# Altium project Incubator_PCB.PrjPcb
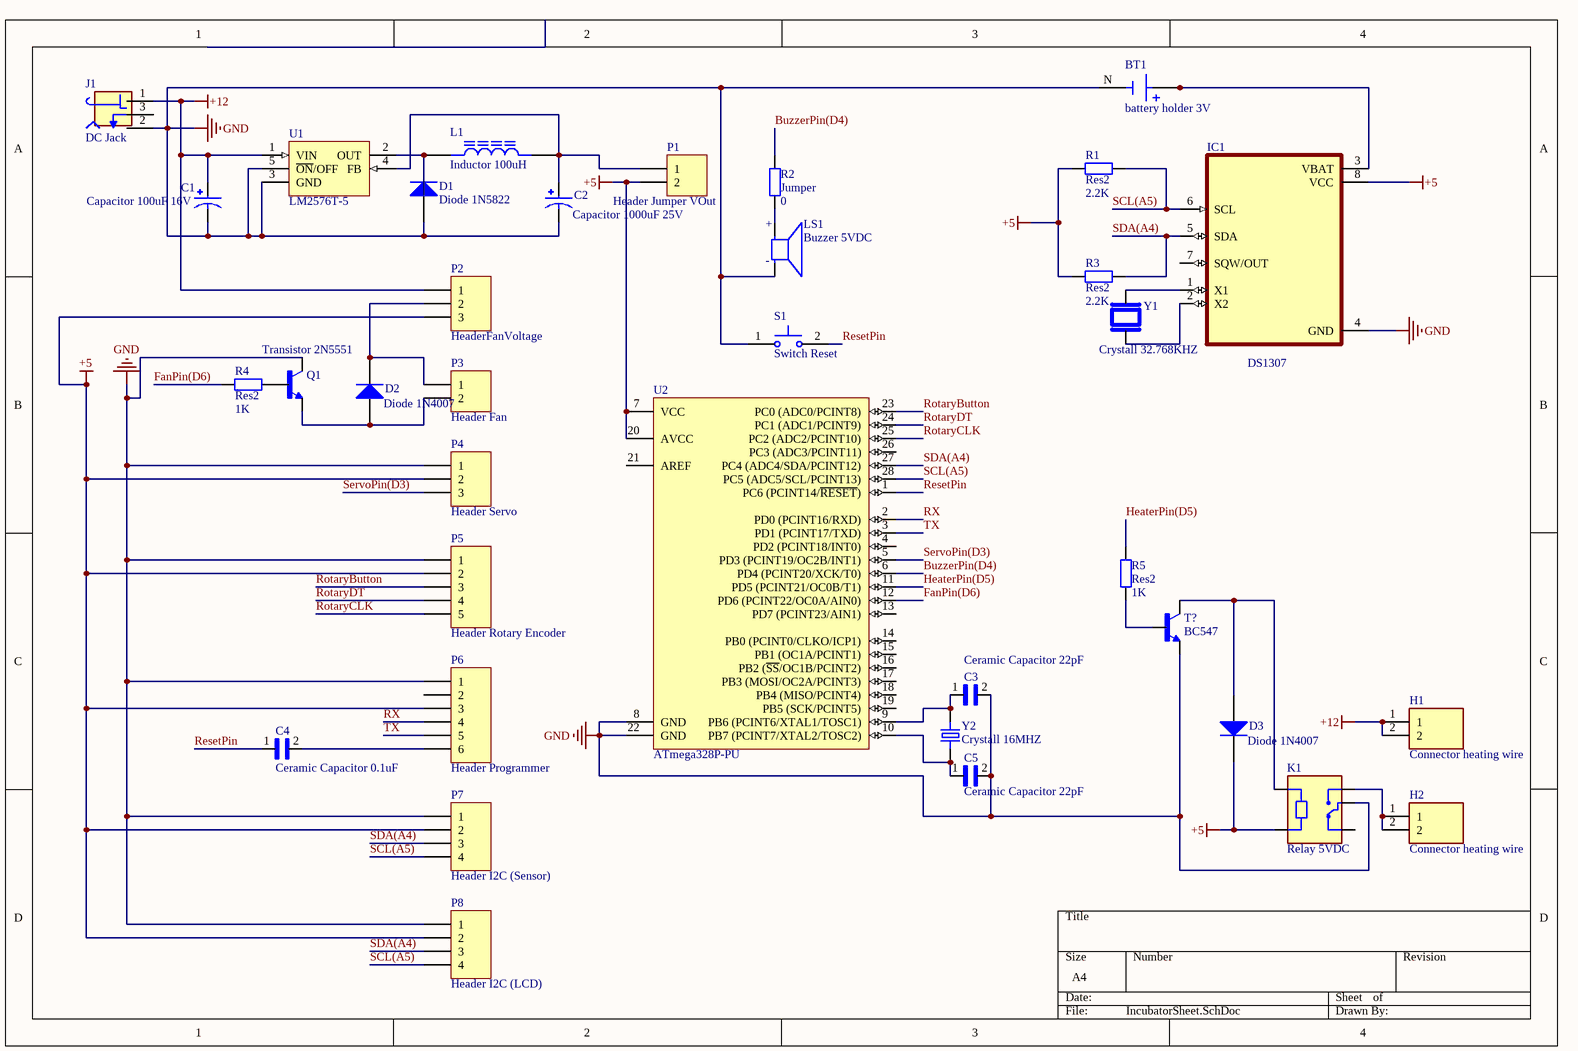
[diagram p0: IncubatorSheet.SchDoc]
1 sheet, 36 parts. Net scope: global (net labels, ports and power ports of the same name join across sheets).
Board file: IncubatorPCB.PcbDoc

## Sheet IncubatorSheet.SchDoc
size A4; SheetNumber: 1; SheetTotal: 1

### Parts
BT1  battery holder 3V  [BAT_1074]
C1  Capacitor 100uF 16V  [CAPPRD250W50D500H1100]
C2  Capacitor 1000uF 25V  [CAPPRD500W60D1250H2500]
C3  Ceramic Capacitor 22pF  [CAP_RDE5C2A220J0M1H03A]
C4  Ceramic Capacitor 0.1uF  [CAP_RDE5C2A220J0M1H03A]
C5  Ceramic Capacitor 22pF  [CAP_RDE5C2A220J0M1H03A]
D1  Diode 1N5822  [DO-201AD]
D2  Diode 1N4007  [DO-41]
D3  Diode 1N4007  [DO-41]
H1  Connector heating wire  [TERMINAL_PCRS-250]
H2  Connector heating wire  [TERMINAL_PCRS-250]
IC1  DS1307  [DIP794W47P254L991H457Q8]
J1  DC Jack  [XKB_DC-005-5A-2.0]
K1  Relay 5VDC  [RELAY_SRD-05VDC-SL-C]
L1  Inductor 100uH  [IND_RLB9012-101KL]
LS1  Buzzer 5VDC  [CUI_CMI-1295IC-0585T]
P1  Header Jumper VOut  [HDR1X2]
P2  HeaderFanVoltage  [HDR1X3]
P3  Header Fan  [HDR1X2]
P4  Header Servo  [HDR1X3]
P5  Header Rotary Encoder  [HDR1X5]
P6  Header Programmer  [HDR1X6]
P7  Header I2C (Sensor)  [HDR1X4]
P8  Header I2C (LCD)  [HDR1X4]
Q1  Transistor 2N5551  [TO92127P520H787-3]
R1  Res2  value 2.2K  [AXIAL-0.4]
R2  Jumper  value 0  [AXIAL-0.4]
R3  Res2  value 2.2K  [AXIAL-0.4]
R4  Res2  value 1K  [AXIAL-0.4]
R5  Res2  value 1K  [AXIAL-0.4]
S1  Switch Reset  [SW_BUTT-2]
T?  BC547  [TO92]
U1  LM2576T-5  [314D-03]
U2  ATmega328P-PU  [28P3]
Y1  Crystall 32.768KHZ  [XTAL_AB15T-32.768KHZ]
Y2  Crystall 16MHZ  [XTAL_ECS-160-20-4X]

### Nets
+5: D3.2(K) IC1.8(VCC) K1.A2 P1.2 P2.3 P4.2 P5.2 P6.3 P7.2 P8.2 R1.1 R3.1 U2.7(VCC) U2.20(AVCC)
+12: C1.P H1.1 H1.2 J1.1 P2.1 U1.1(VIN)
GND: BT1.N(NEG) C1.N C2.N C3.2 C5.2 D1.1(A) IC1.4(GND) J1.2 K1.COM LS1.N P4.1 P5.1 P6.1 P7.1 P8.1 Q1.3(C) S1.1 T?.1(E) U1.3(GND) U1.5(~{ON}/OFF) U2.8(GND) U2.22(GND)
BuzzerPin(D4): R2.1 U2.6(PD4_(PCINT20/XCK/T0))
FanPin(D6): R4.1 U2.12(PD6_(PCINT22/OC0A/AIN0))
HeaterPin(D5): R5.2 U2.11(PD5_(PCINT21/OC0B/T1))
ResetPin: C4.1 S1.2 U2.1(PC6_(PCINT14/~{RESET}))
RotaryButton: P5.3 U2.23(PC0_(ADC0/PCINT8))
RotaryCLK: P5.5 U2.25(PC2_(ADC2/PCINT10))
RotaryDT: P5.4 U2.24(PC1_(ADC1/PCINT9))
RX: P6.4 U2.2(PD0_(PCINT16/RXD))
SCL(A5): IC1.6(SCL) P7.4 P8.4 R1.2 U2.28(PC5_(ADC5/SCL/PCINT13))
SDA(A4): IC1.5(SDA) P7.3 P8.3 R3.2 U2.27(PC4_(ADC4/SDA/PCINT12))
ServoPin(D3): P4.3 U2.5(PD3_(PCINT19/OC2B/INT1))
TX: P6.5 U2.3(PD1_(PCINT17/TXD))
NetBT1_P_1: BT1.P_1(POS) BT1.P_2(POS) IC1.3(VBAT)
NetC2_P: C2.P L1.2 P1.1 U1.4(FB)
NetC3_1: C3.1 U2.9(PB6_(PCINT6/XTAL1/TOSC1)) Y2.1
NetC4_2: C4.2 P6.6
NetC5_1: C5.1 U2.10(PB7_(PCINT7/XTAL2/TOSC2)) Y2.2
NetD1_2: D1.2(K) L1.1 U1.2(OUT)
NetD2_1: D2.1(A) P3.2 Q1.1(E)
NetD2_2: D2.2(K) P2.2 P3.1
NetD3_1: D3.1(A) K1.A1 T?.3(C)
NetH2_1: H2.1 H2.2 K1.NO
NetIC1_1: IC1.1(X1) Y1.1
NetIC1_2: IC1.2(X2) Y1.2
NetLS1_P: LS1.P R2.2
NetQ1_2: Q1.2(B) R4.2
NetR5_1: R5.1 T?.2(B)

Not connected (* = marked no-connect by the designer): IC1 7(SQW/OUT); J1 3; K1 NC; P6 2; U2 4(PD2_(PCINT18/INT0)) 13(PD7_(PCINT23/AIN1)) 14(PB0_(PCINT0/CLKO/ICP1)) 15(PB1_(OC1A/PCINT1)) 16(PB2_(~{SS}/OC1B/PCINT2)) 17(PB3_(MOSI/OC2A/PCINT3)) 18(PB4_(MISO/PCINT4)) 19(PB5_(SCK/PCINT5)) 21(AREF) 26(PC3_(ADC3/PCINT11))

### Notes on the sheet
- (in symbol CMI-1295IC-0585T) +; -

### Library data of the parts
BT1 = 1074: Availability: Unavailable; Price: None; MP: 1074; Package: None; Value: *
C1 = EEUHD1C101: CAP ALUM 100UF 20% 16V RADIAL; MF: Panasonic; Availability: In Stock; Check_prices: https://www.snapeda.com/parts/EEUHD1C101/Panasonic/view-part/5791153/?ref=eda; SnapEDA_Link: https://www.snapeda.com/parts/EEUHD1C101/Panasonic/view-part/5791153/?ref=snap; Package: RADIAL-2 Panasonic; MP: EEUHD1C101; Value: *; Price: None
C2 = EEUTA1E102LB: CAP ALUM 1000UF 20% 25V RADIAL; MF: Panasonic; MP: EEUTA1E102LB; Package: RADIAL-2 Panasonic; Availability: No availability data; Price: None; Check_prices: https://www.snapeda.com/parts/EEUTA1E102LB/Panasonic/view-part/5789306/?ref=eda; SnapEDA_Link: https://www.snapeda.com/parts/EEUTA1E102LB/Panasonic/view-part/5789306/?ref=snap; Value: *
C3-C5 = RDE5C2A220J0M1H03A: Lead Capacitor C0G_EIA_ with Capacitance: 22pF and Rated Voltage: 100Vdc; MF: Murata; Availability: Unavailable; Price: None; Package: Radial Murata; Value: *; SnapEDA_Link: https://www.snapeda.com/parts/RDE5C2A220J0M1H03A/Murata/view-part/4545539/?ref=snap; MP: RDE5C2A220J0M1H03A
D1 = Diode 1N5408: 3 Amp Medium Power Silicon Rectifier Diode; Published: 8-Jun-2000; LatestRevisionDate: 17-Jul-2002; LatestRevisionNote: Re-released for DXP Platform.; DatasheetVersion: Aug-1984; PackageReference: DO-201AD; Publisher: Altium Limited; PackageDescription: Diode, Axial; Body 9.5 x 5.3 mm (LxDia. max), Lead Dia. 1.32 mm (max); ComponentLink1Description: Manufacturer Link; ComponentLink1URL: http://www.irf.com/
D2 D3 = Diode 1N4007: 1 Amp General Purpose Rectifier; Published: 8-Jun-2000; LatestRevisionDate: 17-Jul-2002; LatestRevisionNote: Re-released for DXP Platform.; DatasheetVersion: 1998; PackageVersion: Aug-1999; PackageReference: DO-41; Publisher: Altium Limited; PackageDescription: Diode, Axial; Body 5.2 x 2.7 mm (LxDia. max), Lead Dia. 0.86 mm (max); Code_JEDEC: DO-204-AL; ComponentLink1Description: Manufacturer Link; ComponentLink1URL: http://www.fairchildsemi.com/; ComponentLink2Description: Datasheet; ComponentLink2URL: http://www.fairchildsemi.com/ds/1N%2F1N4001.pdf
H1 H2 = PCRS-250: PCRS250- Valcon PCB Mount Spade Terminal, 10.5mm PCB Profile; Value: *; Price: None; Package: None; Availability: Unavailable; MP: PCRS-250
IC1 = DS1307: Real Time Clock (RTC) IC Clock/Calendar 56B IÂ²C, 2-Wire Serial 8-SOIC (0.154, 3.90mm Width); MF: Maxim Integrated; MP: DS1307; Price: None; Purchase-URL: https://pricing.snapeda.com/search/part/DS1307/?ref=eda; Package: DIP-8 Maxim Integrated; Check_prices: https://www.snapeda.com/parts/DS1307/Maxim+Integrated/view-part/?ref=eda; Value: *; Availability: In Stock; SnapEDA_Link: https://www.snapeda.com/parts/DS1307/Maxim+Integrated/view-part/?ref=snap
J1 = DC-005-5A-2.0: DC Power Receptacle Jack, Through Holeï¼ŒRight Angle; MF: XKB Industrial Precision; SnapEDA_Link: https://www.snapeda.com/parts/DC-005-5A-2.0/XKB+Industrial+Precision/view-part/?ref=snap; Package: Package; Value: *; MP: DC-005-5A-2.0; Check_prices: https://www.snapeda.com/parts/DC-005-5A-2.0/XKB+Industrial+Precision/view-part/?ref=eda
K1 = SRD-05VDC-SL-C: 5V Trigger Relay Module For Arduino And Raspberry Pi 5V Trigger Relay Module For Arduino And Raspberry Pi; MF: Songle Relay; Check_prices: https://www.snapeda.com/parts/SRD-05VDC-SL-C/Songle+Relay/view-part/?ref=eda; Value: *; Availability: Not in stock; Price: None; Package: NON STANDARD-5 Songle Relay; MP: SRD-05VDC-SL-C; SnapEDA_Link: https://www.snapeda.com/parts/SRD-05VDC-SL-C/Songle+Relay/view-part/?ref=snap
L1 = RLB9012-101KL: Value: *; Package: None; Price: None; Availability: Unavailable; MP: RLB9012-101KL
LS1 = CMI-1295IC-0585T: 12 mm, 5 Vdc, 85 dB, Through Hole, Driving Circuit, Magnetic Audio Indicator Buzzer; MF: CUI Devices; Purchase-URL: https://pricing.snapeda.com/search/part/CMI-1295IC-0585T/?ref=eda; CUI_purchase_URL: https://www.cuidevices.com/product/audio/buzzers/audio-indicators/cmi-1295ic-0585t?utm_source=snapeda.com&utm_medium=referral&utm_campaign=snapedaBOM; Package: Package; SnapEDA_Link: https://www.snapeda.com/parts/CMI-1295IC-0585T/CUI+Devices/view-part/?ref=snap; Value: *; MP: CMI-1295IC-0585T; Check_prices: https://www.snapeda.com/parts/CMI-1295IC-0585T/CUI+Devices/view-part/?ref=eda; Availability: In Stock; Price: None
P1 P3 = Header 2: Header, 2-Pin; LatestRevisionDate: 17-Jul-2002; LatestRevisionNote: Re-released for DXP Platform.; Publisher: Altium Limited
P2 P4 = Header 3: Header, 3-Pin; LatestRevisionDate: 17-Jul-2002; LatestRevisionNote: Re-released for DXP Platform.; Publisher: Altium Limited
P5 = Header 5: Header, 5-Pin; LatestRevisionDate: 17-Jul-2002; LatestRevisionNote: Re-released for DXP Platform.; Publisher: Altium Limited
P6 = Header 6: Header, 6-Pin; LatestRevisionDate: 17-Jul-2002; LatestRevisionNote: Re-released for DXP Platform.; Publisher: Altium Limited
P7 P8 = Header 4: Header, 4-Pin; LatestRevisionDate: 17-Jul-2002; LatestRevisionNote: Re-released for DXP Platform.; Publisher: Altium Limited
Q1 = 2N5551: Bipolar (BJT) Transistor NPN 160 V 600 mA 300MHz 625 mW Through Hole TO-92 (TO-226); MF: ON Semiconductor; Value: *; SnapEDA_Link: https://www.snapeda.com/parts/2N5551/Onsemi/view-part/?ref=snap; MP: 2N5551; Check_prices: https://www.snapeda.com/parts/2N5551/Onsemi/view-part/?ref=eda; Availability: Not in stock; Price: None; Package: E-PKG AXIAL-LEADED-2 ON Semiconductor
R1-R5 = Res2: Resistor; Published: 8-Jun-2000; LatestRevisionDate: 17-Jul-2002; LatestRevisionNote: Re-released for DXP Platform.; PackageReference: AXIAL-0.4; Publisher: Altium Limited; PackageDescription: Axial Device, Thru-Hole; 2 Leads; 0.4 in Pin Spacing
S1 = BUTT-2: Tactile Switches MINI PUSH BUTTON SWITCH 2-PIN QTY. 4; MF: Gravitech; Purchase-URL: https://pricing.snapeda.com/search/part/BUTT-2/?ref=eda; Package: None; Value: *; Check_prices: https://www.snapeda.com/parts/BUTT-2/Gravitech/view-part/?ref=eda; SnapEDA_Link: https://www.snapeda.com/parts/BUTT-2/Gravitech/view-part/?ref=snap; Availability: In Stock; Price: None; MP: BUTT-2
T? = BC547: Bipolar (BJT) Transistor NPN 45V 100mA 300MHz 625mW Through Hole TO-92 (TO-226); MF: ON; Package: E-PKG AXIAL-LEADED-2 ON Semiconductor; MP: BC547; SnapEDA_Link: https://www.snapeda.com/parts/BC547/Onsemi/view-part/?ref=snap; Value: *; Availability: In Stock; Price: None; Check_prices: https://www.snapeda.com/parts/BC547/Onsemi/view-part/?ref=eda; Purchase-URL: https://pricing.snapeda.com/search/part/BC547/?ref=eda
U1 = LM2576T-5: Easy Switcher 3.0A Step-Down Voltage Regulator; Published: 15-Apr-2002; DatasheetVersion: Jul-1999; PackageVersion: Jul-1999; PackageReference: 314D-03; Publisher: Altium Limited; PackageDescription: TO, Thru-Hole, Vertical, Heatsink Mounted; 5 In-Line Leads; Pitch 1.70 mm; Code_JEDEC: TS-001-AA; ComponentLink1Description: Manufacturer Link; ComponentLink1URL: http://www.onsemi.com/site/products/taxonomy/0,4438,503,00.html; ComponentLink2Description: Datasheet; ComponentLink2URL: http://www.onsemi.com/pub/Collateral/LM2576-D.PDF
U2 = ATmega328P-PU: 8-bit AVR Microcontroller, 32KB Flash, 1KB EEPROM, 2KB SRAM, 28-pin PDIP, Industrial Grade (-40°C to 85°C); DatasheetVersion: revD, May-2011; PackageVersion: revB, Sep-2001; PackageReference: 28P3; PackageDescription: 28-lead (0.300"/7.62mm Wide) Plastic Dual Inline Package (PDIP); ComponentLink1Description: Manufacturer URL; ComponentLink1URL: http://www.atmel.com/; ComponentLink2Description: ATmega48A/48PA/88A/88PA/168A/168PA/328/328P Datasheet; ComponentLink2URL: http://www.atmel.com/dyn/resources/prod_documents/8271.pdf; ComponentLink3Description: ATmega48A/48PA/88A/88PA/168A/168PA/328/328P Summary; ComponentLink3URL: http://www.atmel.com/dyn/resources/prod_documents/8271S.pdf
Y1 = AB15T-32.768KHZ: MP: AB15T-32.768KHZ; Price: None; Package: None; Availability: Unavailable; Value: *
Y2 = ECS-160-S-4: 16MHz Â±30ppm Crystal Series 40 Ohms HC-49/US; MF: ECS Inc.; SnapEDA_Link: https://www.snapeda.com/parts/ECS-160-S-4/ECS%20Inc./view-part/3657575/?ref=snap; Value: *; Availability: Unavailable; Price: None; MP: ECS-160-S-4; Package: HC49/US ECS International